# Altium schematic sheet YakupTrkn2.SchDoc
size A4
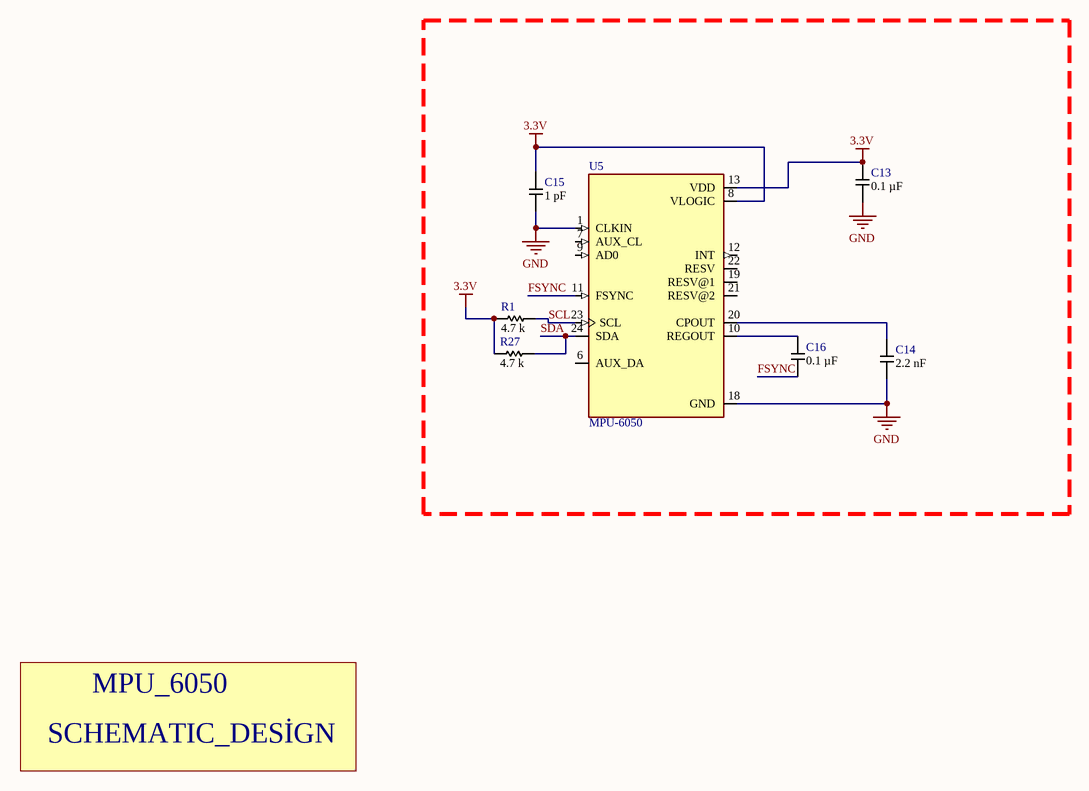
[diagram p0: YakupTrkn2.SchDoc]

## Parts
C13  Capacitance: 0.1 µF  [SAMSUNG_CAP_0805_095]  (hidden comment: CL21B104MACNNNC)
C14  Capacitance: 2.2 nF  [SAMSUNG_CAP_0805_075]  (hidden comment: CL21B222KBANNNC_1)
C15  Capacitance: 1 pF  [SAMSUNG_CAP_0603_090]  (hidden comment: CL10C010BB8NNNC)
C16  Capacitance: 0.1 µF  [SAMSUNG_CAP_0805_095]  (hidden comment: CL21B104MACNNNC)
R1  Resistance: 4.7 k  [ROYALOHM_RES_0603]  (hidden comment: 0603SAJ0472TDE)
R27  Resistance: 4.7 k  [ROYALOHM_RES_0603]  (hidden comment: 0603SAJ0472TDE)
U5  MPU-6050  [QFN50P400X400X95-24N]

## Nets
3.3V: C13.2 C15.2 R1.1 R27.2 U5.8(VLOGIC) U5.13(VDD)
GND: C13.1 C14.1 C15.1 U5.1(CLKIN) U5.18(GND)
FSYNC: C16.1 U5.11(FSYNC)
SCL: R1.2 U5.23(SCL)
SDA: R27.1 U5.24(SDA)
NetC14_2: C14.2 U5.20(CPOUT)
NetC16_2: C16.2 U5.10(REGOUT)

Not connected (* = marked no-connect by the designer): U5 6(AUX_DA) 7(AUX_CL) 9(AD0) 12(INT) 19(RESV@1) 21(RESV@2) 22(RESV)

## Notes on the sheet
- MPU_6050
- SCHEMATIC_DESİGN

## Library data of the parts
C13 C16 = CL21B104MACNNNC: CAP CER 0.1UF 25V X7R 0805; Supplier 1: Digi-Key; Supplier 2: Mouser; Supplier 3: Arrow Electronics; Supplier Part Number 1: 1276-2449-1-ND; Supplier Part Number 2: 187-CL21B104MACNNNC; Supplier Part Number 3: CL21B104MACNNNC
C14 = CL21B222KBANNNC_1: CAP CER 2200PF 50V X7R 0805; Supplier 1: Digi-Key; Supplier 2: Farnell; Supplier 3: Mouser; Supplier Part Number 1: 1276-1171-1-ND; Supplier Part Number 2: 3013488; Supplier Part Number 3: 187-CL21B222KBANNNC
C15 = CL10C010BB8NNNC: CAP CER 1PF 50V C0G/NP0 0603; Supplier 1: Digi-Key; Supplier 2: Arrow Electronics; Supplier Part Number 1: 1276-1095-1-ND; Supplier Part Number 2: CL10C010BB8NNNC
R1 R27 = 0603SAJ0472TDE: RES SMD 4.7K OHM 5% 1/10W 0603
U5 = MPU-6050: MPU-6050 Six-Axis (Gyro + Accelerometer) MEMS MotionTrackingâ„¢ Devices; MF: {'manufacturer': u'TDK InvenSense'}; Availability: Unavailable; Value: *; Package: None; Price: None; MP: MPU-6050